# Altium schematic sheet Misc_IO.SchDoc: Scuba Doo Misc I/O
size B; Organization: CWRUbotix; Address1: 10900 Euclid Avenue; Address2: Cleveland, OH 44106; Address3: USA; SheetNumber: 5; SheetTotal: 6
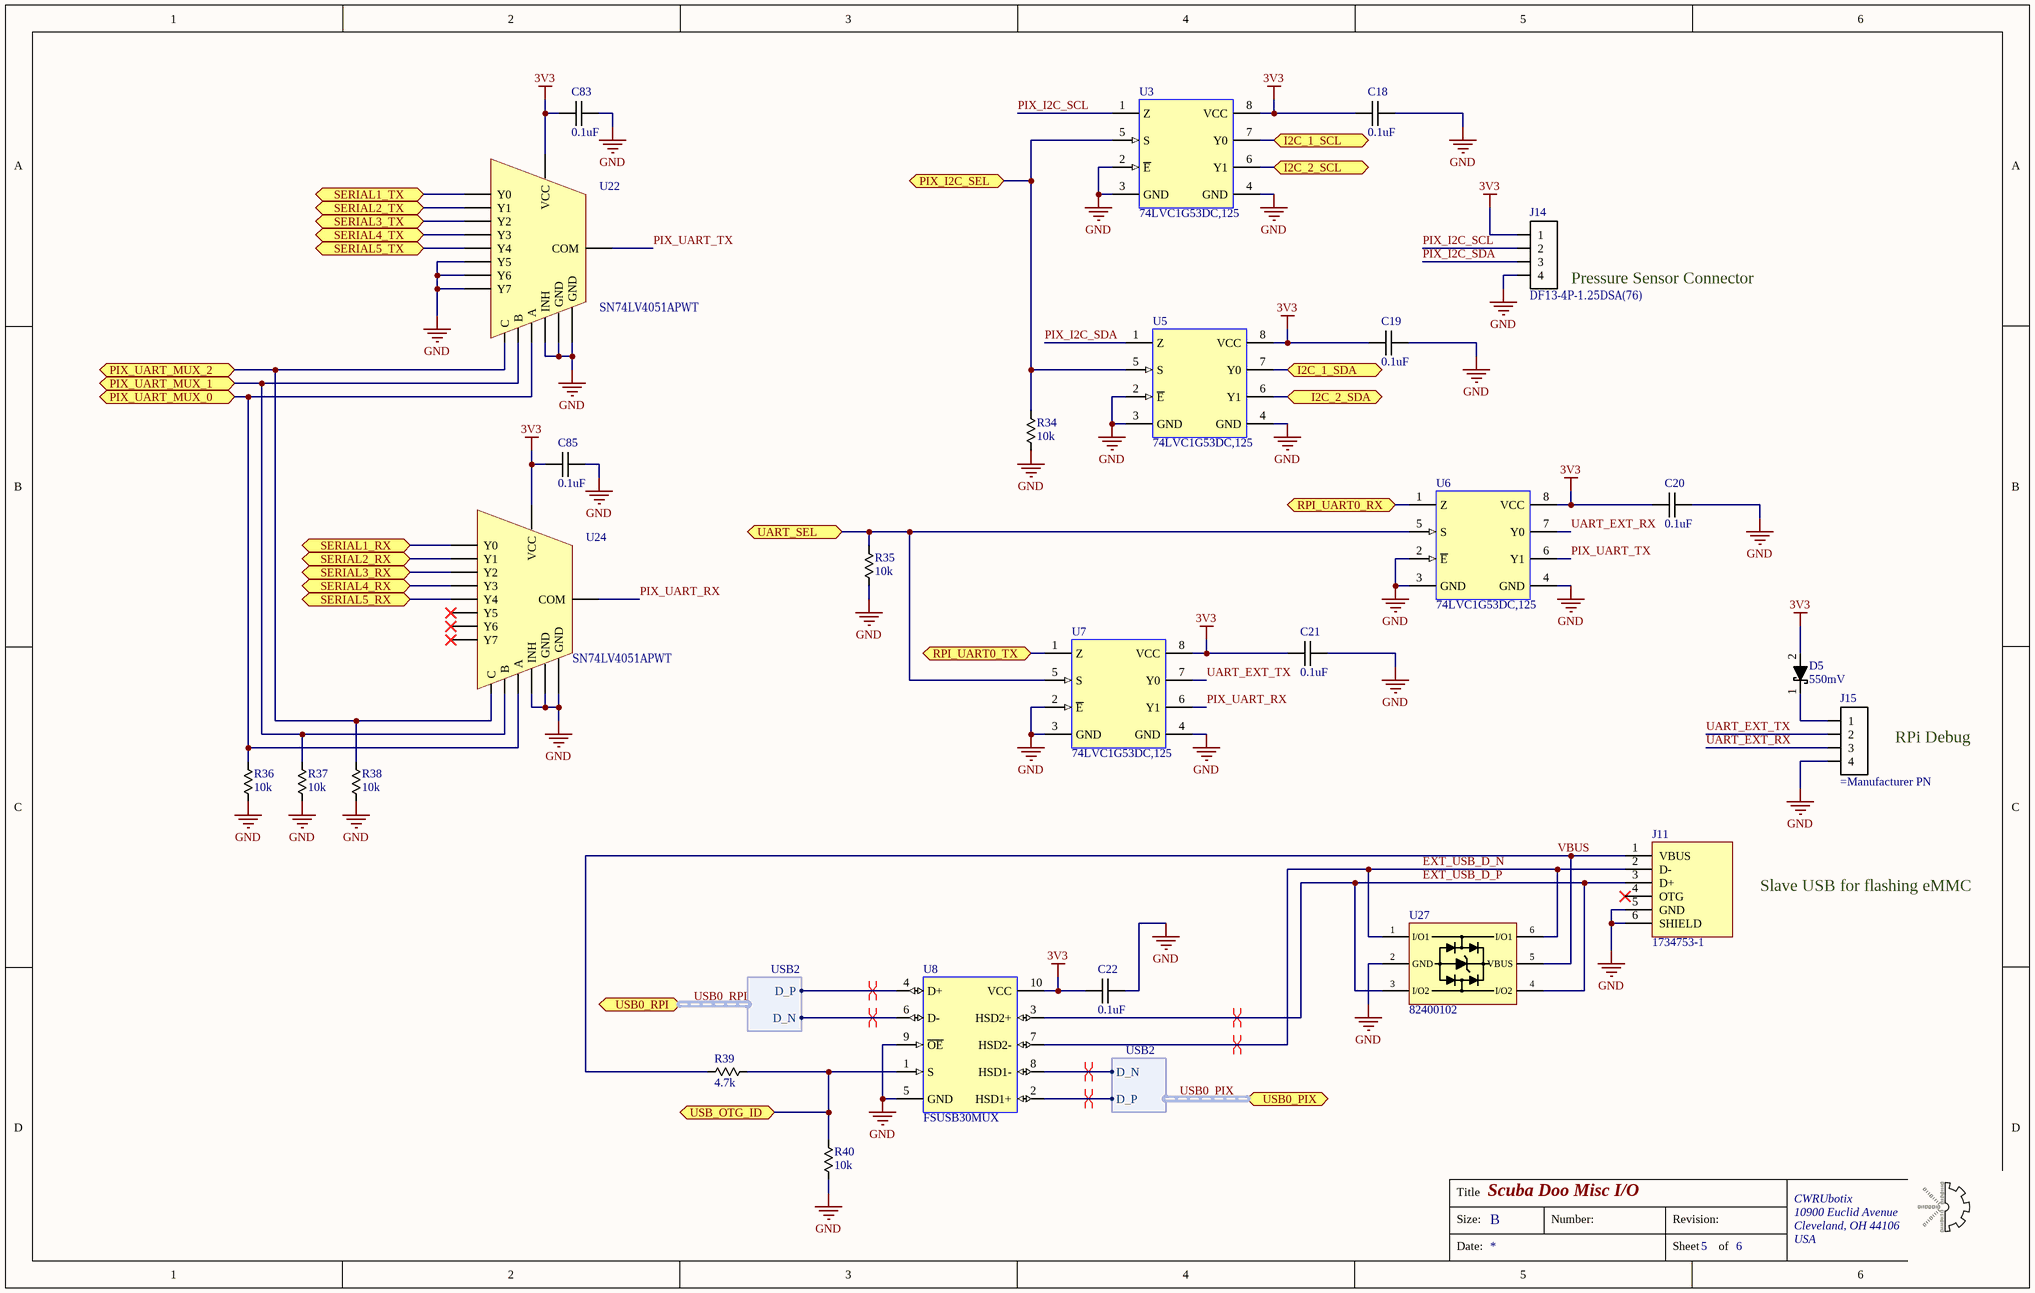
[diagram p0: Misc_IO.SchDoc]

## Parts
C18  0.1uF  [chip_0603]
C19  0.1uF  [chip_0603]
C20  0.1uF  [chip_0603]
C21  0.1uF  [chip_0603]
C22  0.1uF  [chip_0603]
C83  0.1uF  [chip_0603]
C85  0.1uF  [chip_0603]
D5  550mV  [sod123_0]
J11  1734753-1  [TE_1734753-1]
J14  DF13-4P-1.25DSA(76)‎  [HIROSE_DF13-4P-1-25DSA]
J15  (no value)  [HDDR_4x1_0]
R34  10k  [chip_0603]
R35  10k  [chip_0603]
R36  10k  [chip_0603]
R37  10k  [chip_0603]
R38  10k  [chip_0603]
R39  4.7k  [chip_0603]
R40  10k  [chip_0603]
U3  74LVC1G53DC,125  [VSSOP-8_2x2.3_P0.5mm]
U5  74LVC1G53DC,125  [VSSOP-8_2x2.3_P0.5mm]
U6  74LVC1G53DC,125  [VSSOP-8_2x2.3_P0.5mm]
U7  74LVC1G53DC,125  [VSSOP-8_2x2.3_P0.5mm]
U8  FSUSB30MUX  [MSOP-10]
U22  SN74LV4051APWT‎  [TSSOP-16_0_1]
U24  SN74LV4051APWT‎  [TSSOP-16_0_1]
U27  82400102  [sot-23-6]

## Ports
I2C_1_SCL (bidir), I2C_1_SDA (bidir), I2C_2_SCL (bidir), I2C_2_SDA (bidir), PIX_I2C_SEL (bidir), PIX_UART_MUX_0 (bidir), PIX_UART_MUX_1 (bidir), PIX_UART_MUX_2 (bidir), RPI_UART0_RX (bidir), RPI_UART0_TX (bidir), SERIAL1_RX (bidir), SERIAL1_TX (bidir), SERIAL2_RX (bidir), SERIAL2_TX (bidir), SERIAL3_RX (bidir), SERIAL3_TX (bidir), SERIAL4_RX (bidir), SERIAL4_TX (bidir), SERIAL5_RX (bidir), SERIAL5_TX (bidir), UART_SEL (bidir), USB0_PIX (bidir, harness USB2), USB0_RPI (bidir, harness USB2), USB_OTG_ID (bidir)

## Harnesses
USB2: D_N, D_P

## Nets
3V3: C18.2 C19.2 C20.2 C21.2 C22.1 C83.2 C85.2 D5.2 J14.1 U3.8(VCC) U5.8(VCC) U6.8(VCC) U7.8(VCC) U8.10(VCC) U22.16(VCC) U24.16(VCC)
GND: C18.1 C19.1 C20.1 C21.1 C22.2 C83.1 C85.1 J11.5(GND) J11.6(SHIELD) J14.4 J15.4 R34.2 R35.2 R36.2 R37.2 R38.2 R40.2 U3.2(~{E}) U3.3(GND) U3.4(GND) U5.2(~{E}) U5.3(GND) U5.4(GND) U6.2(~{E}) U6.3(GND) U6.4(GND) U7.2(~{E}) U7.3(GND) U7.4(GND) U8.5(GND) U8.9(~{OE}) U22.2(Y6) U22.4(Y7) U22.5(Y5) U22.6(INH) U22.7(GND) U22.8(GND) U24.6(INH) U24.7(GND) U24.8(GND) U27.2(GND)
EXT_USB_D_N: J11.2(D-) U8.7(HSD2-) U27.1(I/O1) U27.6(I/O1)
EXT_USB_D_P: J11.3(D+) U8.3(HSD2+) U27.3(I/O2) U27.4(I/O2)
I2C_1_SCL: U3.7(Y0) ; port I2C_1_SCL
I2C_1_SDA: U5.7(Y0) ; port I2C_1_SDA
I2C_2_SCL: U3.6(Y1) ; port I2C_2_SCL
I2C_2_SDA: U5.6(Y1) ; port I2C_2_SDA
PIX_I2C_SCL: J14.2 U3.1(Z)
PIX_I2C_SDA: J14.3 U5.1(Z)
PIX_I2C_SEL: R34.1 U3.5(S) U5.5(S) ; port PIX_I2C_SEL
PIX_UART_MUX_0: R36.1 U22.11(A) U24.11(A) ; port PIX_UART_MUX_0
PIX_UART_MUX_1: R37.1 U22.10(B) U24.10(B) ; port PIX_UART_MUX_1
PIX_UART_MUX_2: R38.1 U22.9(C) U24.9(C) ; port PIX_UART_MUX_2
PIX_UART_RX: U7.6(Y1) U24.3(COM)
PIX_UART_TX: U6.6(Y1) U22.3(COM)
RPI_UART0_RX: U6.1(Z) ; port RPI_UART0_RX
RPI_UART0_TX: U7.1(Z) ; port RPI_UART0_TX
SERIAL1_RX: U24.13(Y0) ; port SERIAL1_RX
SERIAL1_TX: U22.13(Y0) ; port SERIAL1_TX
SERIAL2_RX: U24.14(Y1) ; port SERIAL2_RX
SERIAL2_TX: U22.14(Y1) ; port SERIAL2_TX
SERIAL3_RX: U24.15(Y2) ; port SERIAL3_RX
SERIAL3_TX: U22.15(Y2) ; port SERIAL3_TX
SERIAL4_RX: U24.12(Y3) ; port SERIAL4_RX
SERIAL4_TX: U22.12(Y3) ; port SERIAL4_TX
SERIAL5_RX: U24.1(Y4) ; port SERIAL5_RX
SERIAL5_TX: U22.1(Y4) ; port SERIAL5_TX
UART_EXT_RX: J15.3 U6.7(Y0)
UART_EXT_TX: J15.2 U7.7(Y0)
UART_SEL: R35.1 U6.5(S) U7.5(S) ; port UART_SEL
USB0_PIX.D_N: U8.8(HSD1-) ; port USB0_PIX.D_N
USB0_PIX.D_P: U8.2(HSD1+) ; port USB0_PIX.D_P
USB0_RPI.D_N: U8.6(D-) ; port USB0_RPI.D_N
USB0_RPI.D_P: U8.4(D+) ; port USB0_RPI.D_P
USB_OTG_ID: R39.2 R40.1 U8.1(S) ; port USB_OTG_ID
VBUS: J11.1(VBUS) R39.1 U27.5(VBUS)
NetD5_1: D5.1 J15.1

Not connected (* = marked no-connect by the designer): J11 4(OTG)*; U24 2(Y6)* 4(Y7)* 5(Y5)*

## Buses and harness runs
harness USB0_PIX = port USB0_PIX
harness USB0_RPI = port USB0_RPI

## Layout directives
differential pair; differential pair class USB2-0: EXT_USB_D_N, EXT_USB_D_P, USB0_PIX.D_N, USB0_PIX.D_P, USB0_RPI.D_N, USB0_RPI.D_P

## Notes on the sheet
- (near J14) Pressure Sensor Connector
- RPi Debug
- Slave USB for flashing eMMC
- Title
- Size:
- B
- Number:
- Revision:
- Date:
- Sheet
- of

## Library data of the parts
C18-C22 C83 C85 = CAP-00542: CAP, 0.1uF, ±10%, 16V, X7R, 0603; Manufacturer: Murata; Part Number: CAP-00542; Capacitance: 0.1uF; Tolerance: ±10%; Voltage Rating: 16V; Type: X7R
D5 = DIO-00001: Dio Shtky, 1A, 0.55V, 40V, SOD-123; Manufacturer: ON Semi; Manufacturer PN: MBR140SFT1G; Type: Schottky; Part Number: DIO-00001; Forward Voltage: 550mV; Reverse Breakdown Voltage: 40V; Current Rating: 1A
J11 = CONN-00125: USB Mini B Receptacle, USB 2.0, Vertical, Thru-Hole; Manufacturer: TE Connectivity; Positions per level: 5; Levels: 1; Part Number: CONN-00125; Type: Receptacle; Manufacturer PN: 1734753-1; Cost: 1.87; Distributor Link: https://www.digikey.com/en/products/detail/te-connectivity-amp-connectors/1734753-1/4021671
J14 = CONN-00118: Header, 4-Pos, Shrouded, 1.25mm Pitch, Vertical, Thru-Hole; Manufacturer: Hirose Electric Co Ltd; Positions per level: 4; Levels: 1; Part Number: CONN-00118; Type: Header; Manufacturer PN: DF13-4P-1.25DSA; Cost: 0.44; Distributor Link: https://www.digikey.com/en/products/detail/DF13-4P-1.25DSA/H2193-ND/241767
J15 = CONN-00029: Header 4x1, 0.1"; Positions per level: 4; Levels: 1; Part Number: CONN-00029; Type: Header
R34-R38 R40 = RES-00306: RES SMD 10K OHM 1% 1/4W 0603; Manufacturer: Panasonic; Manufacturer PN: ERJ-PA3F1002V; Power Rating: 0.25W; Part Number: RES-00306; Resistance: 10k; Tolerance: 1%; Cost: 0.144
R39 = RES-00470: RES SMD 4.7K OHM 1% 1/4W 0603; Manufacturer: Panasonic; Manufacturer PN: ERJ-PA3F4701V; Power Rating: 0.25W; Part Number: RES-00470; Resistance: 4.7k; Tolerance: 1%
U3 U5-U7 = LOGIC-00048: IC, Analog Mux/Demux 2:1, 8-VSSOP; Manufacturer: Nexperia; Part Number: LOGIC-00048; Manufacturer PN: 74LVC1G53DC,125; Cost: 0.67; Distributor Link: https://www.digikey.com/en/products/detail/nexperia-usa-inc/74LVC1G53DC-125/1023284
U8 = IFACE-00037: IC, High-Speed USB 2.0 Switch, DPDT, FSUSB30, 10-MSOP; Manufacturer: onsemi; Part Number: IFACE-00037; Manufacturer PN: FSUSB30MUX; Cost: 0.6; Distributor Link: https://www.digikey.com/en/products/detail/onsemi/FSUSB30MUX/1245063
U22 U24 = LOGIC-00018: IC, Analog Mux/Demux, 8:1, TSSOP-16, SN74LV4051; Manufacturer: TI; Manufacturer PN: SN74LV4051APWR; Part Number: LOGIC-00018; Cost: $0.42
U27 = DIO-00069: ESD Protec, 2-Ch, 2.5pF, 17V clamping voltage, SOT23-6; Manufacturer: ST; Manufacturer PN: USBLC6-2SC6Y; Forward Voltage: 1.1V; Reverse Breakdown Voltage: 6V; Current Rating: 5A; Part Number: DIO-00069; Type: TVS; Cost: 0.73